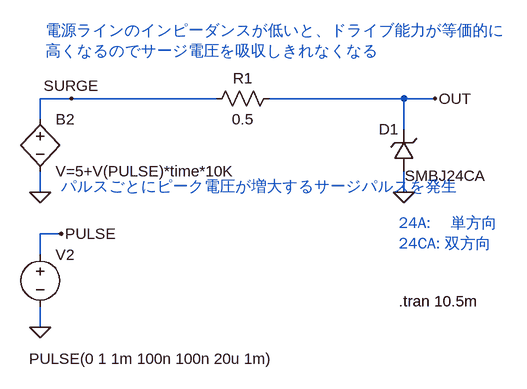
[diagram p0: schematic Fig_2-126_TVS_SMBJ24CA.asc]
Fig_2-126_TVS_SMBJ24CA.asc, the LTspice schematic file:
Version 4
SHEET 1 880 680
WIRE -48 112 -96 112
WIRE 176 112 -48 112
WIRE 464 112 256 112
WIRE 512 112 464 112
WIRE -96 144 -96 112
WIRE 464 160 464 112
WIRE -96 256 -96 224
WIRE 464 256 464 224
WIRE -64 320 -96 320
WIRE -96 352 -96 320
WIRE -96 464 -96 432
FLAG 464 256 0
FLAG 512 112 OUT
FLAG -96 464 0
FLAG -64 320 PULSE
FLAG -96 256 0
FLAG -48 112 SURGE
SYMBOL TVSdiode 480 224 R180
WINDOW 0 24 65 Left 2
WINDOW 3 -109 -7 Left 2
SYMATTR InstName D1
SYMATTR Value SMBJ24CA
SYMBOL voltage -96 336 R0
WINDOW 3 -17 176 Left 2
WINDOW 123 0 0 Left 2
WINDOW 39 0 0 Left 2
SYMATTR Value PULSE(0 1 1m 100n 100n 20u 1m)
SYMATTR InstName V2
SYMBOL bv -96 128 R0
SYMATTR InstName B2
SYMATTR Value V=5+V(PULSE)*time*10K
SYMBOL res 160 128 R270
WINDOW 0 32 56 VTop 2
WINDOW 3 0 56 VBottom 2
SYMATTR InstName R1
SYMATTR Value 0.5
TEXT 456 304 Left 2 ;24A: 　単方向\n24CA: 双方向
TEXT 456 424 Left 2 !.tran 10.5m
TEXT -64 248 Left 2 ;パルスごとにピーク電圧が増大するサージパルスを発生
TEXT -88 8 Left 2 ;電源ラインのインピーダンスが低いと、ドライブ能力が等価的に\n高くなるのでサージ電圧を吸収しきれなくなる

The netlist it stands for:
* Fig_2-126_TVS_SMBJ24CA.asc
D1 0 OUT SMBJ24CA
V2 PULSE 0 PULSE(0 1 1m 100n 100n 20u 1m)
B2 SURGE 0 V=5+V(PULSE)*time*10K
R1 SURGE OUT 0.5
.model D D
.lib standard.dio
* 24A: 　単方向
* 24CA: 双方向
.tran 10.5m
* パルスごとにピーク電圧が増大するサージパルスを発生
* 電源ラインのインピーダンスが低いと、ドライブ能力が等価的に
* 高くなるのでサージ電圧を吸収しきれなくなる
.backanno
.end